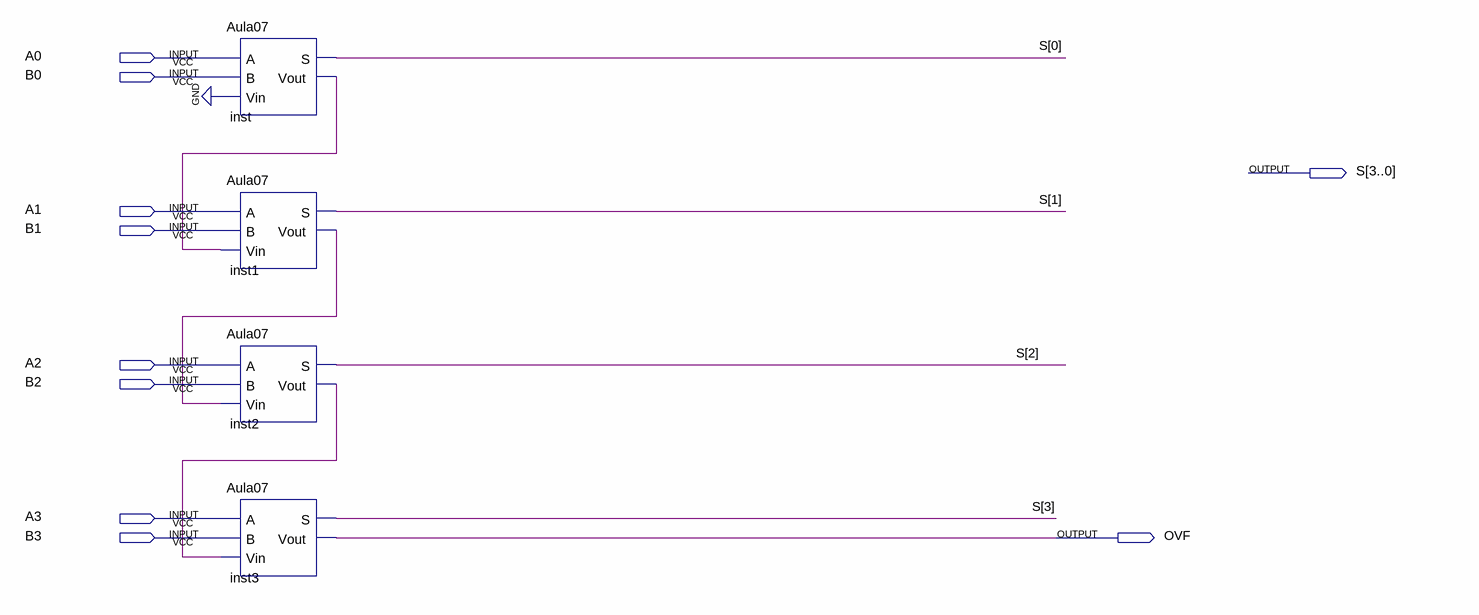
[diagram p0: schematic sheet]
// Quartus schematic Aula08.bdf as structural Verilog: 4 symbols, 10 pins
module Aula08 (
  input  A0,
  input  B0,
  input  A1,
  input  B1,
  input  A2,
  input  B2,
  input  A3,
  input  B3,
  output [3:0] S,
  output OVF
);

  wire inst1_vout, inst2_vout, inst_vout;

  Aula07 inst (.A(A0), .B(B0), .Vin(1'b0), .S(S[0]), .Vout(inst_vout));
  Aula07 inst1 (.A(A1), .B(B1), .Vin(inst_vout), .S(S[1]), .Vout(inst1_vout));
  Aula07 inst2 (.A(A2), .B(B2), .Vin(inst1_vout), .S(S[2]), .Vout(inst2_vout));
  Aula07 inst3 (.A(A3), .B(B3), .Vin(inst2_vout), .S(S[3]), .Vout(OVF));
endmodule
